# EAGLE design Adafruit Ultimate GPS Featherwing (EAGLE 6.4)
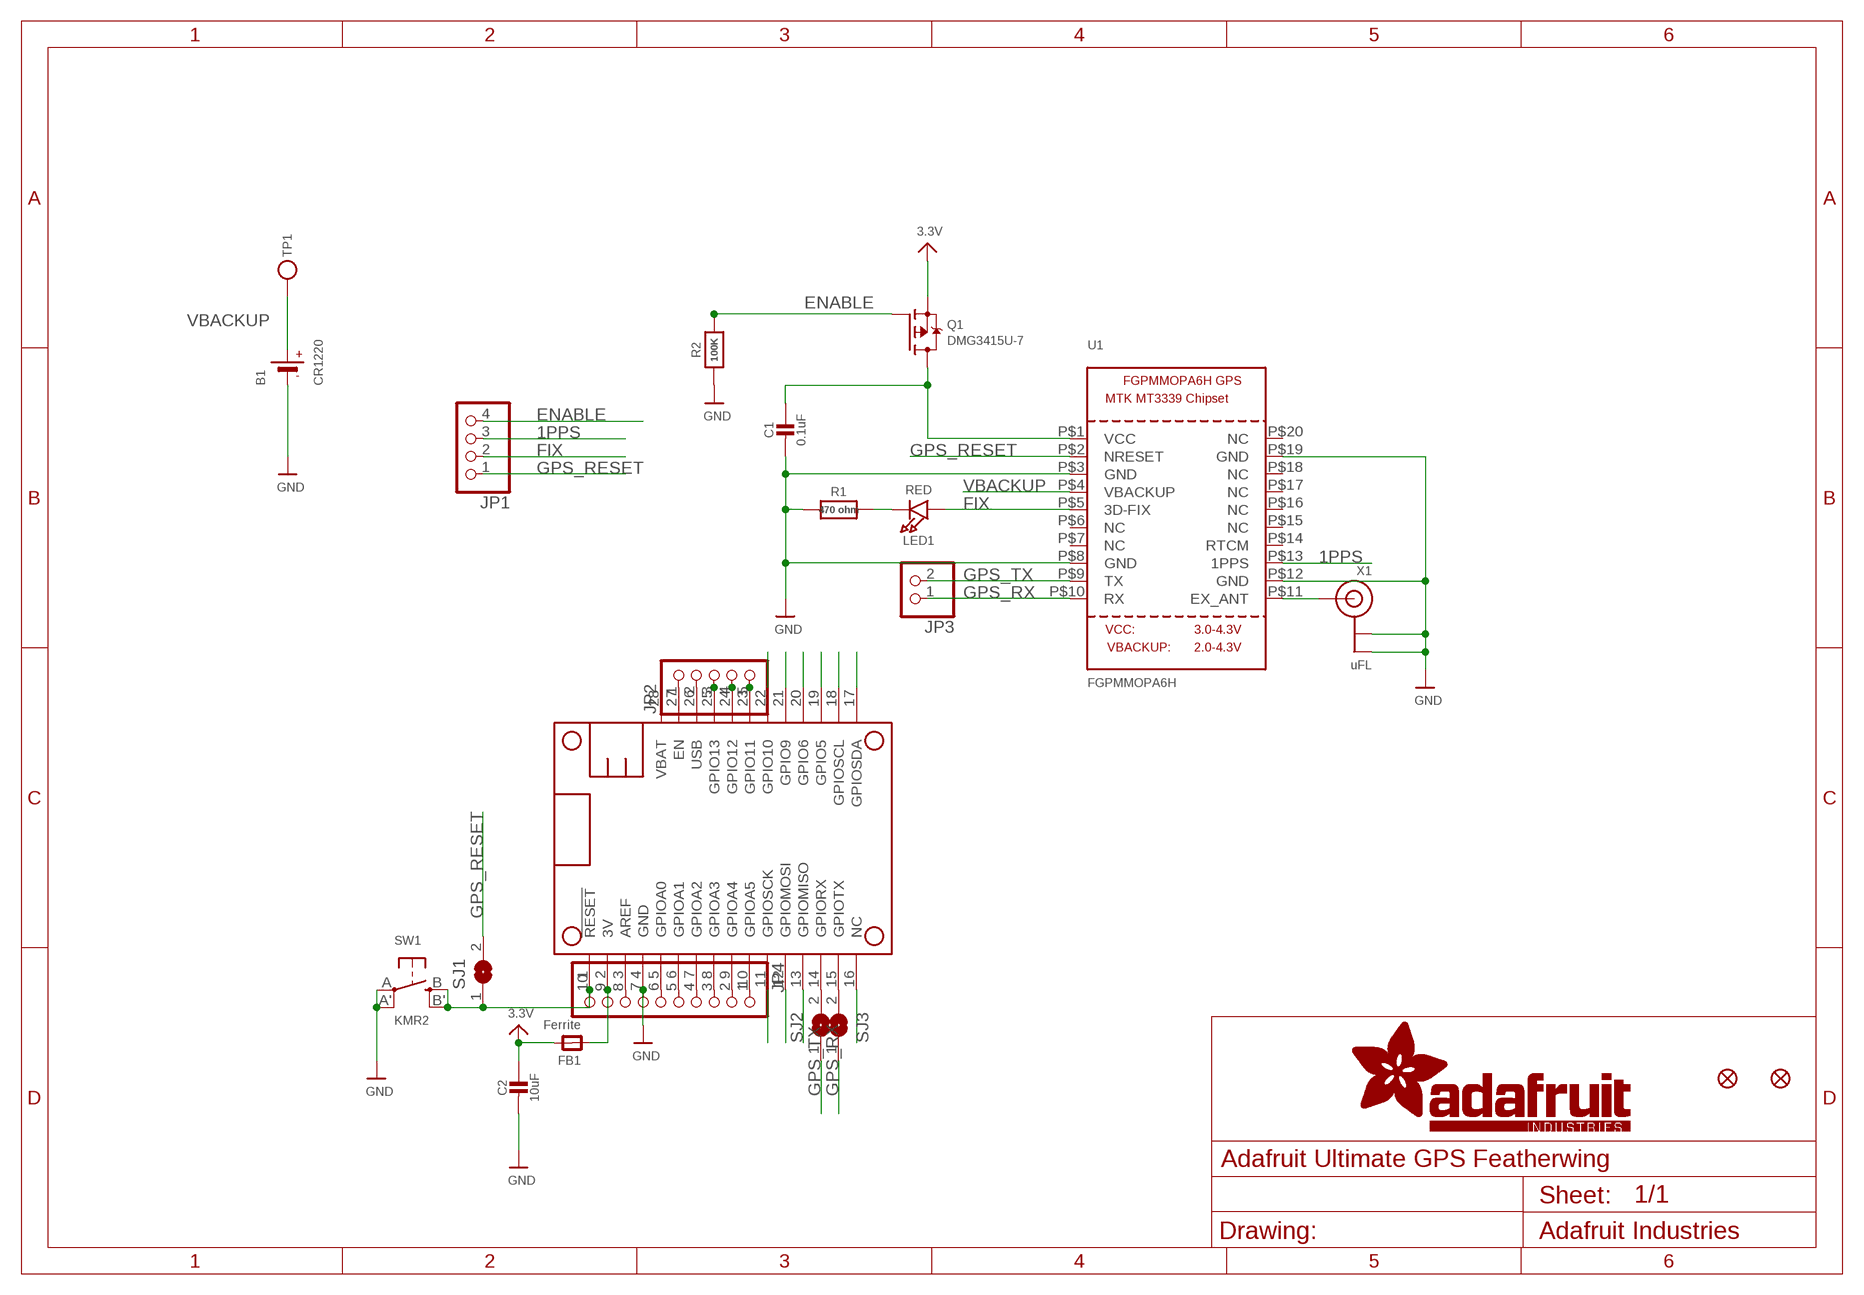
[diagram p0: schematic, sheet 1]

## Parts
B1  CR1220  BATTERYCR1220_2  [CR1220-2]
C1  0.1uF  CAP_CERAMIC0805-NOOUTLINE  [0805-NO]
C2  10uF  CAP_CERAMIC0805-NOOUTLINE  [0805-NO]
FB1  Ferrite  FERRITE-0805NO  [0805-NO]
FID1  FIDUCIAL""  [FIDUCIAL_1MM]
FID2  FIDUCIAL""  [FIDUCIAL_1MM]
JP1  HEADER-1X4ROUND  [1X04_ROUND]
JP2  HEADER-1X570MIL  [1X05_ROUND_70]
JP3  HEADER-1X2ROUND  [1X02_ROUND]
JP4  HEADER-1X10ROUND  [1X10_ROUND]
LED1  RED  LED0805_NOOUTLINE  [CHIPLED_0805_NOOUTLINE]
MS1  FEATHERWING  [FEATHERWING]
Q1  DMG3415U-7  MOSFET-PWIDE  [SOT23-WIDE]
R1  470 ohm  RESISTOR0805_NOOUTLINE  [0805-NO]
R2  100K  RESISTOR0805_NOOUTLINE  [0805-NO]
SJ1  SOLDERJUMPER  [SOLDERJUMPER_ARROW_NOPASTE]
SJ2  SOLDERJUMPERCLOSED  [SOLDERJUMPER_CLOSEDWIRE]
SJ3  SOLDERJUMPERCLOSED  [SOLDERJUMPER_CLOSEDWIRE]
SW1  KMR2  SWITCH_TACT_SMT4.6X2.8  [BTN_KMR2_4.6X2.8]
TP1  TESTPOINTROUND1.5MM  [TESTPOINT_ROUND_1.5MM]
U1  FGPMMOPA6H  GPS_FGPMMOPA6H  [FGPMMOPA6H]
X1  uFL  ANTENNA_U.FL  [U.FL]

## Nets
1PPS: JP1.3 U1.P$13(1PPS)
3.3V: C2.1 FB1.2 Q1.2(S)
3V: FB1.1 JP4.9 MS1.2(3V)
A: JP4.6 MS1.5(GPIOA0)
AREF: JP4.8 MS1.3(AREF)
B: JP4.5 MS1.6(GPIOA1)
C: JP4.4 MS1.7(GPIOA2)
D: JP4.3 MS1.8(GPIOA3)
E: JP4.2 MS1.9(GPIOA4)
EN: JP2.1 MS1.27(EN)
ENABLE: JP1.4 Q1.1(G) R2.2
F: JP4.1 MS1.10(GPIOA5)
FIX: JP1.2 LED1.A U1.P$5(3D-FIX)
G: MS1.16(NC)
GND: B1.- C1.2 C2.2 JP4.7 MS1.4(GND) R1.1 R2.1 SW1.A'(P1) SW1.A(P) U1.P$3(GND) U1.P$8(GND) U1.P$12(GND) U1.P$19(GND) X1.1(GND) X1.2(GND)
GPS_RESET: JP1.1 SJ1.2 U1.P$2(NRESET)
GPS_RX: JP3.1 SJ3.1 U1.P$10(RX)
GPS_TX: JP3.2 SJ2.1 U1.P$9(TX)
H: MS1.19(GPIO5)
I: MS1.20(GPIO6)
J: MS1.21(GPIO9)
K: MS1.22(GPIO10)
L: JP2.5 MS1.23(GPIO11)
M: JP2.4 MS1.24(GPIO12)
MISO: MS1.13(GPIOMISO)
MOSI: MS1.12(GPIOMOSI)
N: JP2.3 MS1.25(GPIO13)
N$2: LED1.C R1.2
N$4: U1.P$11(EX_ANT) X1.3(SIGNAL)
N$15: C1.1 Q1.3(D) U1.P$1(VCC)
RST: JP4.10 MS1.1(!RESET) SJ1.1 SW1.B'(S1) SW1.B(S)
RX: MS1.14(GPIORX) SJ2.2
SCK: MS1.11(GPIOSCK)
SCL: MS1.18(GPIOSCL)
SDA: MS1.17(GPIOSDA)
TX: MS1.15(GPIOTX) SJ3.2
USB: JP2.2 MS1.26(USB)
VBACKUP: B1.+ TP1.P$1 U1.P$4(VBACKUP)
Unconnected: MS1.28(VBAT) U1.P$6(NC) U1.P$7(NC) U1.P$14(RTCM) U1.P$15(NC) U1.P$16(NC) U1.P$17(NC) U1.P$18(NC) U1.P$20(NC)

## Library data of the parts
B1 = microbuilder:BATTERY: CR1220 SMT - Digikey: 3001K-ND CD2032 BAT-HLD-001 - Digikey: BAT-HLD-001-ND
C1 C2 = microbuilder:CAP_CERAMIC: Ceramic Capacitors For new designs, use the packages preceded by an '_' character since they are more reliable: The following footprints should be used on most boards: _0402 - Standard footprint for regular board layouts _0603 - Standard footprint for regular board layouts _0805 - Standard footprint for regular board layouts _1206 - Standard footprint for regular board layouts For extremely tight-pitch boards where space is at a premium, the following 'micro-pitch' footprints can be used (smaller pads, no silkscreen outline, etc.): _0402MP - Micro-pitch footprint for very dense/compact boards _0603MP - Micro-pitch footprint for very dense/compact boards _0805MP - Micro-pitch footprint for very dense/compact boards _1206MP - Micro-pitch footprint for very dense/compact boards
FB1 = microbuilder:FERRITE: Ferrite Bead 0603 MMZ1608B121C - 120 Ohm @ 100MHz, 600mA, 0.15 Ohm DC Resistance - Digikey: 445-2164-1-ND BK1608HW121-T - 120 Ohm, 600mA Ferrite Chip - Digikey: 587-1876-2-ND 0805 HZ0805B272R-10 - 2.7K Ohm @ 100MHz, 200mA, 0.8 Ohm DC Resistance - Digikey: 240-2504-1-ND (see also Murata BLM21BD272SN1L) MMZ2012Y152B - 1.5K Ohm @ 100MHz, 500mA, 0.4 Ohm DC Resistance - Digikey: 445-1560-1-ND - Mainly for high frequency (80-400MHz) MMZ2012R102A - 1K Ohm @ 100MHz, 500mA, 0.3 Ohm DC Resistance - Digikey: 445-1555-2-ND - More general purpose (10-200MHz)
FID1 FID2 = microbuilder:FIDUCIAL: Fiducial Alignment Points Various fiducial points for machine vision alignment.; BOM: EXCLUDE
JP1 = microbuilder:HEADER-1X4: PIN HEADER
JP2 = microbuilder:HEADER-1X5: PIN HEADER
JP3 = microbuilder:HEADER-1X2: PIN HEADER
JP4 = microbuilder:HEADER-1X10: PIN HEADER
LED1 = microbuilder:LED: LED 0603 - 0603 Surface Mount Package 2mA: Green LED - Low Power (3.9mcd, 2ma, 1.7Vf) - Digikey: 475-2709-2-ND Orange LED - Low Power (9.8mcd, 2ma, 1.8Vf) - Digikey: 475-1194-2-ND Red LED - Low Power (5mcd, 2ma, 1.8Vf) - Digikey: 475-1195-2-ND Yellow LED - Low Power (7mcd, 2ma, 1.8Vf) - Digikey: 475-1196-2-ND 5mA: Blue LED - Low Power (17mcd, 5ma, 2.9Vf) - Digikey: LNJ937W8CRACT-ND 0805 - 0805 Surface Mount Package 2mA: Red LED (8.8mcd, 2mA, 1.8Vf, Clear) - Low Power [Digikey: 475-2510-1-ND] Green LED (5mcd, 2mA, 1.8Vf, Clear) - Low Power [Digikey: 475-2730-1-ND] Yellow LED (11.3mcd, 2mA, 1.8Vf, Clear) - Low Power [Digikey: 475-2555-1-ND] 20mA: Red LED (104mcd, 20mA, Diffused) - LS R976 [Digikey: 475-1278-6-ND] Red LED (12mcd, 20mA, 2.0Vf, Clear) - APT2012EC [Digikey: 754-1128-1-ND] Green LED (15mcd, 20mA, 2.2Vf, Clear) - APT2012GC [Digikey: 754-1131-1-ND] Orange LED (160mcd, 20mA, 2.1Vf, Clear) - APT2012SECK [Digikey: 754-1130-1-ND] 1206 - 1206 Surface Mount Package Green LED (26mcd, 20mA, Diffused) - LG N971 [Digikey: 475-1407-6-ND] Red LED (15mcd, 20mA, Diffused) - LH N974 [Digikey: 475-1416-6-ND] Cree - Cree High-Power Surface Mount LEDs XPEBWT-L1-0000-00D50 - White 111lm 350mA 2.9Vf 6200K 110° XTEAWT-00-0000-00000LEE3 - White 114lm 350mA 2.85Vf 5000K 115° Everlight - Everlight 45-21 Series Surface Mount LEDs 45-21/QK2C-B2832AC2CB2/2T - Warm White 2000mcd 20mA 3.25Vf 3050K 120° 45-21/LK2C-B38452C4CB2/2T - Nuetral White 2000mcd 20mA 3.25Vf 4150K 120° 45-21/LK2C-B50634C6CB2/2T - Cold White 2200mcd 20mA 3.25Vf 5650K 120° PLCC2 Reverse Mount LS T77K-J1L2-1-0-2-R18-Z - Red 11.25mcd 2mA 1.8Vf 630nm 120° LO T77K-L1M2-24-Z - Orange 19.6mcd 2mA 1.8Vf 606nm 120° LY T77K-K2M1-26-Z - Yellow 15.7mcd 2mA 1.8Vf 587nm 120°
MS1 = microbuilder:FEATHERWING
Q1 = microbuilder:MOSFET-P: P-Channel Mosfet LEGEND VDS: Voltage Drain-Source ID: Drain Current RDS(ON): Drain-Source On-State Resistance VGS(TH): Gate-Source Threshold Voltage CISS: Drain-Source Input Capacitance SOT-23 Name VDS ID RDS(ON) VGS(TH) CISS Order Number IRLML5103 30V 760mA 600 mOhm -- 75pF @ 25V Digikey: IRLML5103PBFCT-ND IRLML6401 12V 4.3A 50 mOhm 950mV @ 250µA 830pF @ 10V Digikey: IRLML6401PBFTR-ND NTR0202PL 20V 400mA 800 mOhm 2.3V @ 250uA 70pF @ 5V Digikey: NTR0202PLT1GOSTR-ND NTR4101PT1G 20V 1.8A 85 mOhm 1.2V @ 250uA 675pF @ 10V Digikey: NTR4101PT1GOSCT-ND DMP2004K 20V 600mA 900 mOhm 1V @ 250uA 175pF @ 16V Digikey: DMP2004KDICT-ND PMV65XP 20V 3.9A 76 mOhm 950mV @ 1mA 725pF @ 20V Digikey: 568-2358-2-ND TO-252 Name VDS ID RDS(ON) VGS(TH) CISS Order Number AOD417 30V 25A 34 mOhm 3V @ 250µA 920pF @ 15V Digikey: 785-1106-2-ND
R1 R2 = microbuilder:RESISTOR: Resistors For new designs, use the packages preceded by an '_' character since they are more reliable: The following footprints should be used on most boards: _0402 - Standard footprint for regular board layouts _0603 - Standard footprint for regular board layouts _0805 - Standard footprint for regular board layouts _1206 - Standard footprint for regular board layouts For extremely tight-pitch boards where space is at a premium, the following 'micro-pitch' footprints can be used (smaller pads, no silkscreen outline, etc.): _0402MP - Micro-pitch footprint for very dense/compact boards _0603MP - Micro-pitch footprint for very dense/compact boards _0805MP - Micro-pitch footprint for very dense/compact boards _1206MP - Micro-pitch footprint for very dense/compact boards
SJ1 = microbuilder:SOLDERJUMPER: SMD Solder JUMPER Solder the two pads together to create a connection, or remove the solder to break it. REFLOW - Use this footprint for solder paste and reflow ovens. WAVE - Use this footprint for hand-soldering (larger pads). CLOSED - Has a trace between the two pads to ensure it is closed by default. The trace needs to be cut to disable the jumper, and can be closed again by creating a solder bridge between the two pads.; BOM: EXCLUDE
SJ2 SJ3 = microbuilder:SOLDERJUMPER: SMD Solder JUMPER Solder the two pads together to create a connection, or remove the solder to break it. REFLOW - Use this footprint for solder paste and reflow ovens. WAVE - Use this footprint for hand-soldering (larger pads). CLOSED - Has a trace between the two pads to ensure it is closed by default. The trace needs to be cut to disable the jumper, and can be closed again by creating a solder bridge between the two pads.
SW1 = microbuilder:SWITCH_TACT_SMT: SMT Tact Switches 6x6mm - Digikey: P12940SCT-ND KMR2 (4.6x2.8mm) - Digikey: 401-1426-1-ND EVQ-PQHB55 - Light Touch, 160GF (4.5x4.5mm) - Digikey: P8090SCT-ND KMT0 - KMT021 NGJ LHS (etc.) IP68/Waterproof - Digikey: CKN10289CT-ND
TP1 = microbuilder:TESTPOINT: Test Point Various test points for characterisation and PCB testing TESTPOINT_SMT - Compact Surface Mount Test Point [Digikey: 5016KTR-ND]
U1 = microbuilder:GPS_FGPMMOPA6H: GPS Module - MTK MT3339 Chipset, -165dBm sensitivity, 22 channels, 10Hz, auto-select external antenna options
X1 = microbuilder:ANTENNA_U.FL: U.FL Antenna Connector

## Board
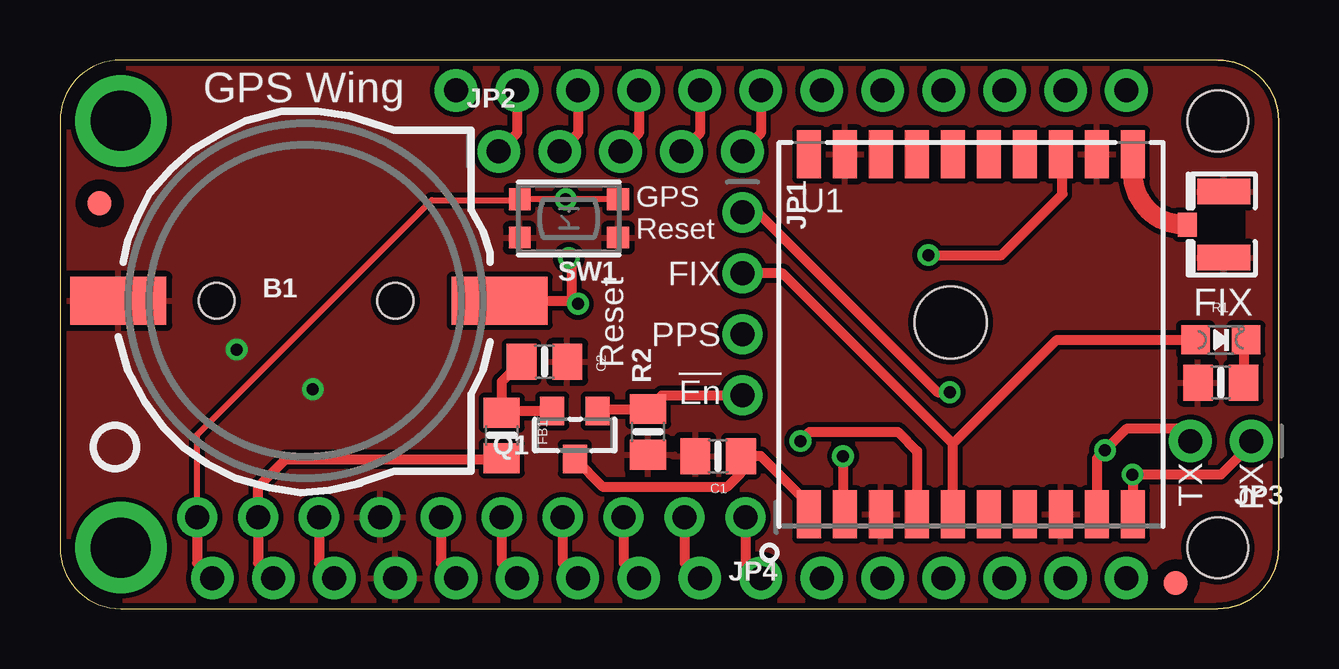
[diagram p1: board, top side]
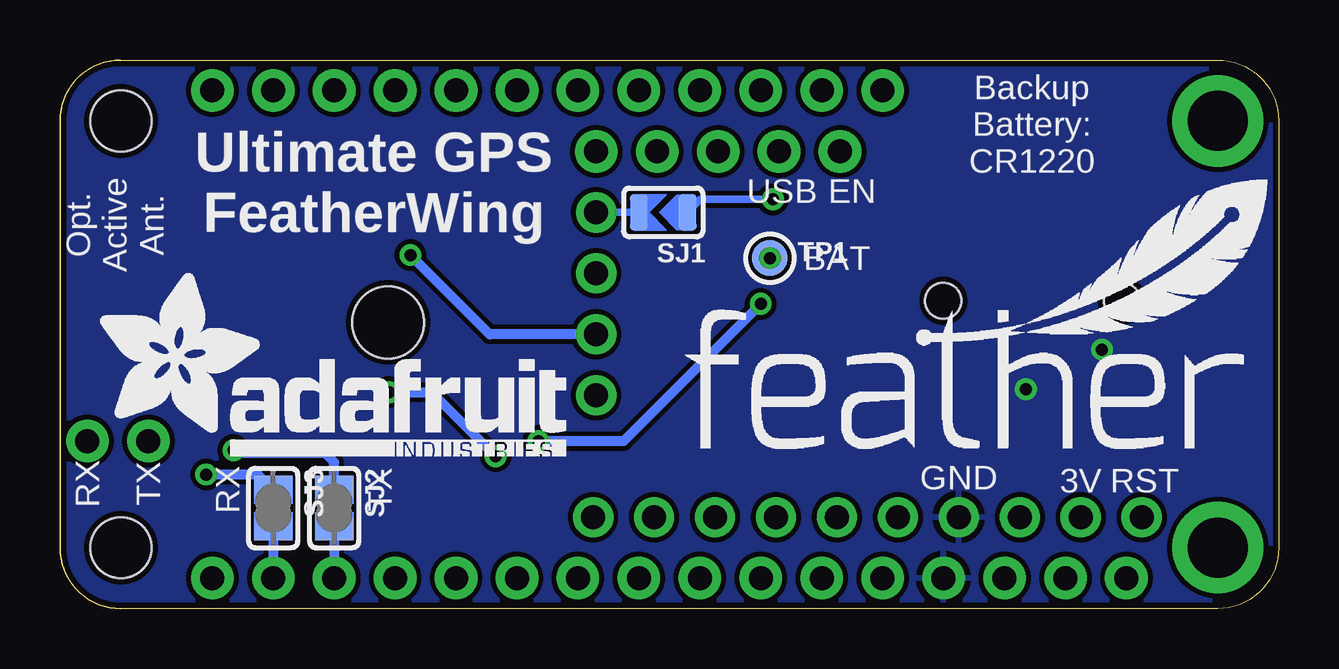
[diagram p2: board, bottom side, seen from below]

Size 50.8 x 22.86 mm. Coordinates in mm from the lower left corner, seen from the top.
Outline: 48.26,22.86 arc-90 50.8,20.32 50.8,2.54 arc-90 48.26,0
Copper layers (1*16): Top 0.035mm / dielectric 1.5mm / Bottom 0.035mm
Design rules "adafruit": minimum track width 8mil, minimum drill 15.5mil, track to track 8mil, track to pad 8mil, pad to pad 8mil, via to via 8mil, smd to smd 8mil, copper to edge 10mil, drill to drill 8mil, minimum pad ring 10mil, minimum via ring 8mil, stop-mask expansion 2mil, vias tented up to drill 20mil, thermal gap 10mil

### Footprints (pad centres in the part's own frame; a part is rotated, then mirrored left to right if it is on the bottom)
CR1220-2 = smd 4 x 2: + 8.29,0; - -7.6,0 | hole 1.5: 3.95,0; -3.5,0
0805-NO = smd 1.24 x 1.5: 1 -0.95,0; 2 0.95,0
FIDUCIAL_1MM = smd 1 x 1: 1 0,0
1X04_ROUND = drill 1 pad 1.676: 1 -3.81,0; 2 -1.27,0; 3 1.27,0; 4 3.81,0
1X05_ROUND_70 = drill 1 pad 1.778: 1 -5.08,0; 2 -2.54,0; 3 0,0; 4 2.54,0; 5 5.08,0
1X02_ROUND = drill 1 pad 1.778: 1 -1.27,0; 2 1.27,0
1X10_ROUND = drill 1 pad 1.676: 1 -11.43,0; 2 -8.89,0; 3 -6.35,0; 4 -3.81,0; 5 -1.27,0; 6 1.27,0; 7 3.81,0; 8 6.35,0; 9 8.89,0; 10 11.43,0
CHIPLED_0805_NOOUTLINE = smd 1.2 x 1.2: A 0,-1.05; C 0,1.05
FEATHERWING = drill 1 pad 1.778: 1 6.35,1.27; 2 8.89,1.27; 3 11.43,1.27; 4 13.97,1.27; 5 16.51,1.27; 6 19.05,1.27; 7 21.59,1.27; 8 24.13,1.27; 9 26.67,1.27; 10 29.21,1.27; 11 31.75,1.27; 12 34.29,1.27; 13 36.83,1.27; 14 39.37,1.27; 15 41.91,1.27; 16 44.45,1.27; 17 44.45,21.59; 18 41.91,21.59; 19 39.37,21.59; 20 36.83,21.59; 21 34.29,21.59; 22 31.75,21.59; 23 29.21,21.59; 24 26.67,21.59; 25 24.13,21.59; 26 21.59,21.59; 27 19.05,21.59; 28 16.51,21.59 | drill 2.5 pad 3.81: P$1 2.54,20.32; P$2 2.54,2.54 | hole 2.54: 48.26,20.32; 48.26,2.54
SOT23-WIDE = smd 1 x 1.2: 1 -0.95,-1; 2 0.95,-1; 3 0,1
SOLDERJUMPER_ARROW_NOPASTE = smd 0.762 x 1.524: 1 -1.016,0; 2 1.016,0
SOLDERJUMPER_CLOSEDWIRE = smd 1.168 x 1.6: 1 -0.762,0; 2 0.762,0 | smd 0.635 x 0.203: WIRE 0,0
BTN_KMR2_4.6X2.8 = smd 0.9 x 0.9: A 2.05,0.8; A' -2.05,0.8; B 2.05,-0.8; B' -2.05,-0.8
TESTPOINT_ROUND_1.5MM = smd 1.5 x 1.5: P$1 0,0
FGPMMOPA6H = smd 2 x 1: P$1 -7.5,6.75; P$2 -7.5,5.25; P$3 -7.5,3.75; P$4 -7.5,2.25; P$5 -7.5,0.75; P$6 -7.5,-0.75; P$7 -7.5,-2.25; P$8 -7.5,-3.75; P$9 -7.5,-5.25; P$10 -7.5,-6.75; P$11 7.5,-6.75; P$12 7.5,-5.25; P$13 7.5,-3.75; P$14 7.5,-2.25; P$15 7.5,-0.75; P$16 7.5,0.75; P$17 7.5,2.25; P$18 7.5,3.75; P$19 7.5,5.25; P$20 7.5,6.75 | hole 3: 0.5,0.85
U.FL = smd 2.2 x 1.05: 1 0,1.375; 2 0,-1.375 | smd 0.8 x 1: 3 1.525,0

### Placement (x,y rotation side)
B1  10.03,12.83 0 top
C1  27.43,6.35 180 top
C2  20.19,10.29 0 top
FB1  18.41,7.21 90 top
FID1  1.65,16.89 0 top
FID2  46.51,1.06 0 top
JP1  28.45,12.7 270 top
JP2  23.37,19.05 0 top
JP3  48.39,6.99 180 top
JP4  17.14,3.81 180 top
LED1  48.39,11.2 270 top
MS1  0,0 0 top
Q1  21.46,7.24 180 top
R1  48.39,9.42 0 top
R2  24.51,7.37 90 top
SJ1  25.65,16.51 180 bottom
SJ2  39.37,4.19 270 bottom
SJ3  41.91,4.19 270 bottom
SW1  21.21,16.26 180 top
TP1  21.21,14.61 0 bottom
U1  37.97,11.43 90 top
U$9  [PCBFEAT-REV-040]  2.29,6.73 0 top
U$10  [FEATHERLOGO]  24.77,6.6 0 bottom
U$11  [ADAFRUIT_TEXT_20MM]  49.28,6.35 0 bottom
X1  48.51,16 180 top

### Tracks (layer width: path | path; a pad name or v marks a point on that pad's centre or on a via)
1PPS  (via drill 0.5)
  Top 0.406: v36.2,14.73 39.24,14.73 41.78,17.27 41.78,18.87 U1.P$13
  Bottom 0.406: JP1.3 32.89,11.43 v36.2,14.73
3.3V
  Top 0.406: Q1.2 18.49,8.24 FB1.2 18.41,9.46 C2.1
3V
  Top 0.406: MS1.2 8.26,1.91 JP4.9 8.26,5.08 9.4,6.22 18.37,6.22 FB1.1
A
  Top 0.406: JP4.6 15.88,1.91 MS1.5
AREF
  Top 0.406: JP4.8 10.79,1.91 MS1.3
B
  Top 0.406: JP4.5 18.41,1.91 MS1.6
C
  Top 0.406: JP4.4 20.95,1.91 MS1.7
D
  Top 0.406: JP4.3 23.5,1.91 MS1.8
E
  Top 0.406: JP4.2 26.04,1.91 MS1.9
EN
  Top 0.406: MS1.27 19.05,19.81 JP2.1
ENABLE
  Top 0.406: Q1.1 22.49,8.32 R2.2 25.09,8.89 JP1.4
F
  Top 0.406: JP4.1 28.57,1.91 MS1.10
FIX
  Top 0.406: U1.P$5 37.22,6.87 | 37.22,6.87 41.55,11.2 LED1.A | 37.22,6.87 30.12,13.97 JP1.2
GND  (via drill 0.5)
  other vias: 7.37,10.79 10.54,9.14
  pour Top: 0,22.86 0,0 50.8,0 50.8,22.86
  pour Bottom: 0,22.86 0,0 50.8,0 50.8,22.86
GPS_RESET  (via drill 0.5)
  Top 0.406: JP1.1 29.08,16.51 36.58,9.02 v37.08,9.02 | v32.64,6.35 32.64,4.01 U1.P$2
  Bottom 0.305: JP1.1 SJ1.2
  Bottom 0.406: v37.08,9.02 35.31,9.02 v32.64,6.35
GPS_RX  (via drill 0.5)
  Top 0.406: JP3.1 49.66,6.86 48.39,5.59 v44.7,5.59 44.72,5.1 U1.P$10
  Bottom 0.406: SJ3.1 42.55,5.59 v44.7,5.59
GPS_TX  (via drill 0.5)
  Top 0.406: JP3.2 46.61,7.49 44.45,7.49 43.62,6.67 v43.56,6.6 43.22,6.27 U1.P$9
  Bottom 0.406: SJ2.1 39.37,6.1 39.75,6.48 43.43,6.48 v43.56,6.6
L
  Top 0.406: MS1.23 29.21,19.81 JP2.5
M
  Top 0.406: MS1.24 26.67,19.81 JP2.4
N
  Top 0.406: MS1.25 24.13,19.81 JP2.3
N$2
  Top 0.406: LED1.C 49.34,10.72 R1.2
N$4
  Top 0.813: U1.P$11 44.72,18.01 arc90 X1.3
N$15
  Top 0.406: U1.P$1 31.11,4.04 31.11,4.45 29.21,6.35 C1.1 28.38,5.65 27.81,5.08 22.62,5.08 Q1.3
RST  (via drill 0.5)
  Top 0.254: SW1.B' v21.08,17.06 | 20.95,17.06 SW1.B 19.12,17.02 15.49,17.02 5.71,7.24 JP4.10
  Top 0.305: v21.08,17.06 20.95,17.06
  Top 0.406: JP4.10 5.71,1.91 MS1.1
  Bottom 0.305: SJ1.1 24.09,17.06 v21.08,17.06
RX
  Bottom 0.406: SJ2.2 MS1.14
TX
  Bottom 0.406: SJ3.2 MS1.15
USB
  Top 0.406: MS1.26 21.59,19.81 JP2.2
VBACKUP  (via drill 0.5)
  Top 0.406: B1.+ 21.34,12.83 | 21.34,12.83 21.46,12.83 v21.59,12.7 | v30.86,6.99 31.24,7.37 34.92,7.37 35.72,6.57 U1.P$4 | 21.34,12.83 21.34,14.48 TP1.P$1
  Bottom 0.406: v21.59,12.7 27.3,6.99 v30.86,6.99
  other vias: 21.21,14.61

### Text on the board
tPlace: GPS Wing | GPS / Reset | FIX | PPS | FIX | Reset | !En | TX | RX
bPlace: Backup / Battery: / CR1220 | Ultimate GPS / FeatherWing | EN | USB | Opt. / Active / Ant. | BAT | RST | 3V | GND | TX | RX | TX | RX